# EasyEDA Pro project ZHub(instead of .json).epro

# Schematic usbhub
Board Name: usbhub; Create Date: 2025-08-07; Page Name: Sheet_1; Project Name: ZHub; Schematic Name: usbhub; Update Date: 2025-08-07; Add into BOM: yes; Company: Your Company; Convert to PCB: yes; Date: 2025-08-05; Draw By: wetcementstudios; REV: 1.0; Sheet: 1/1; spicePre: .
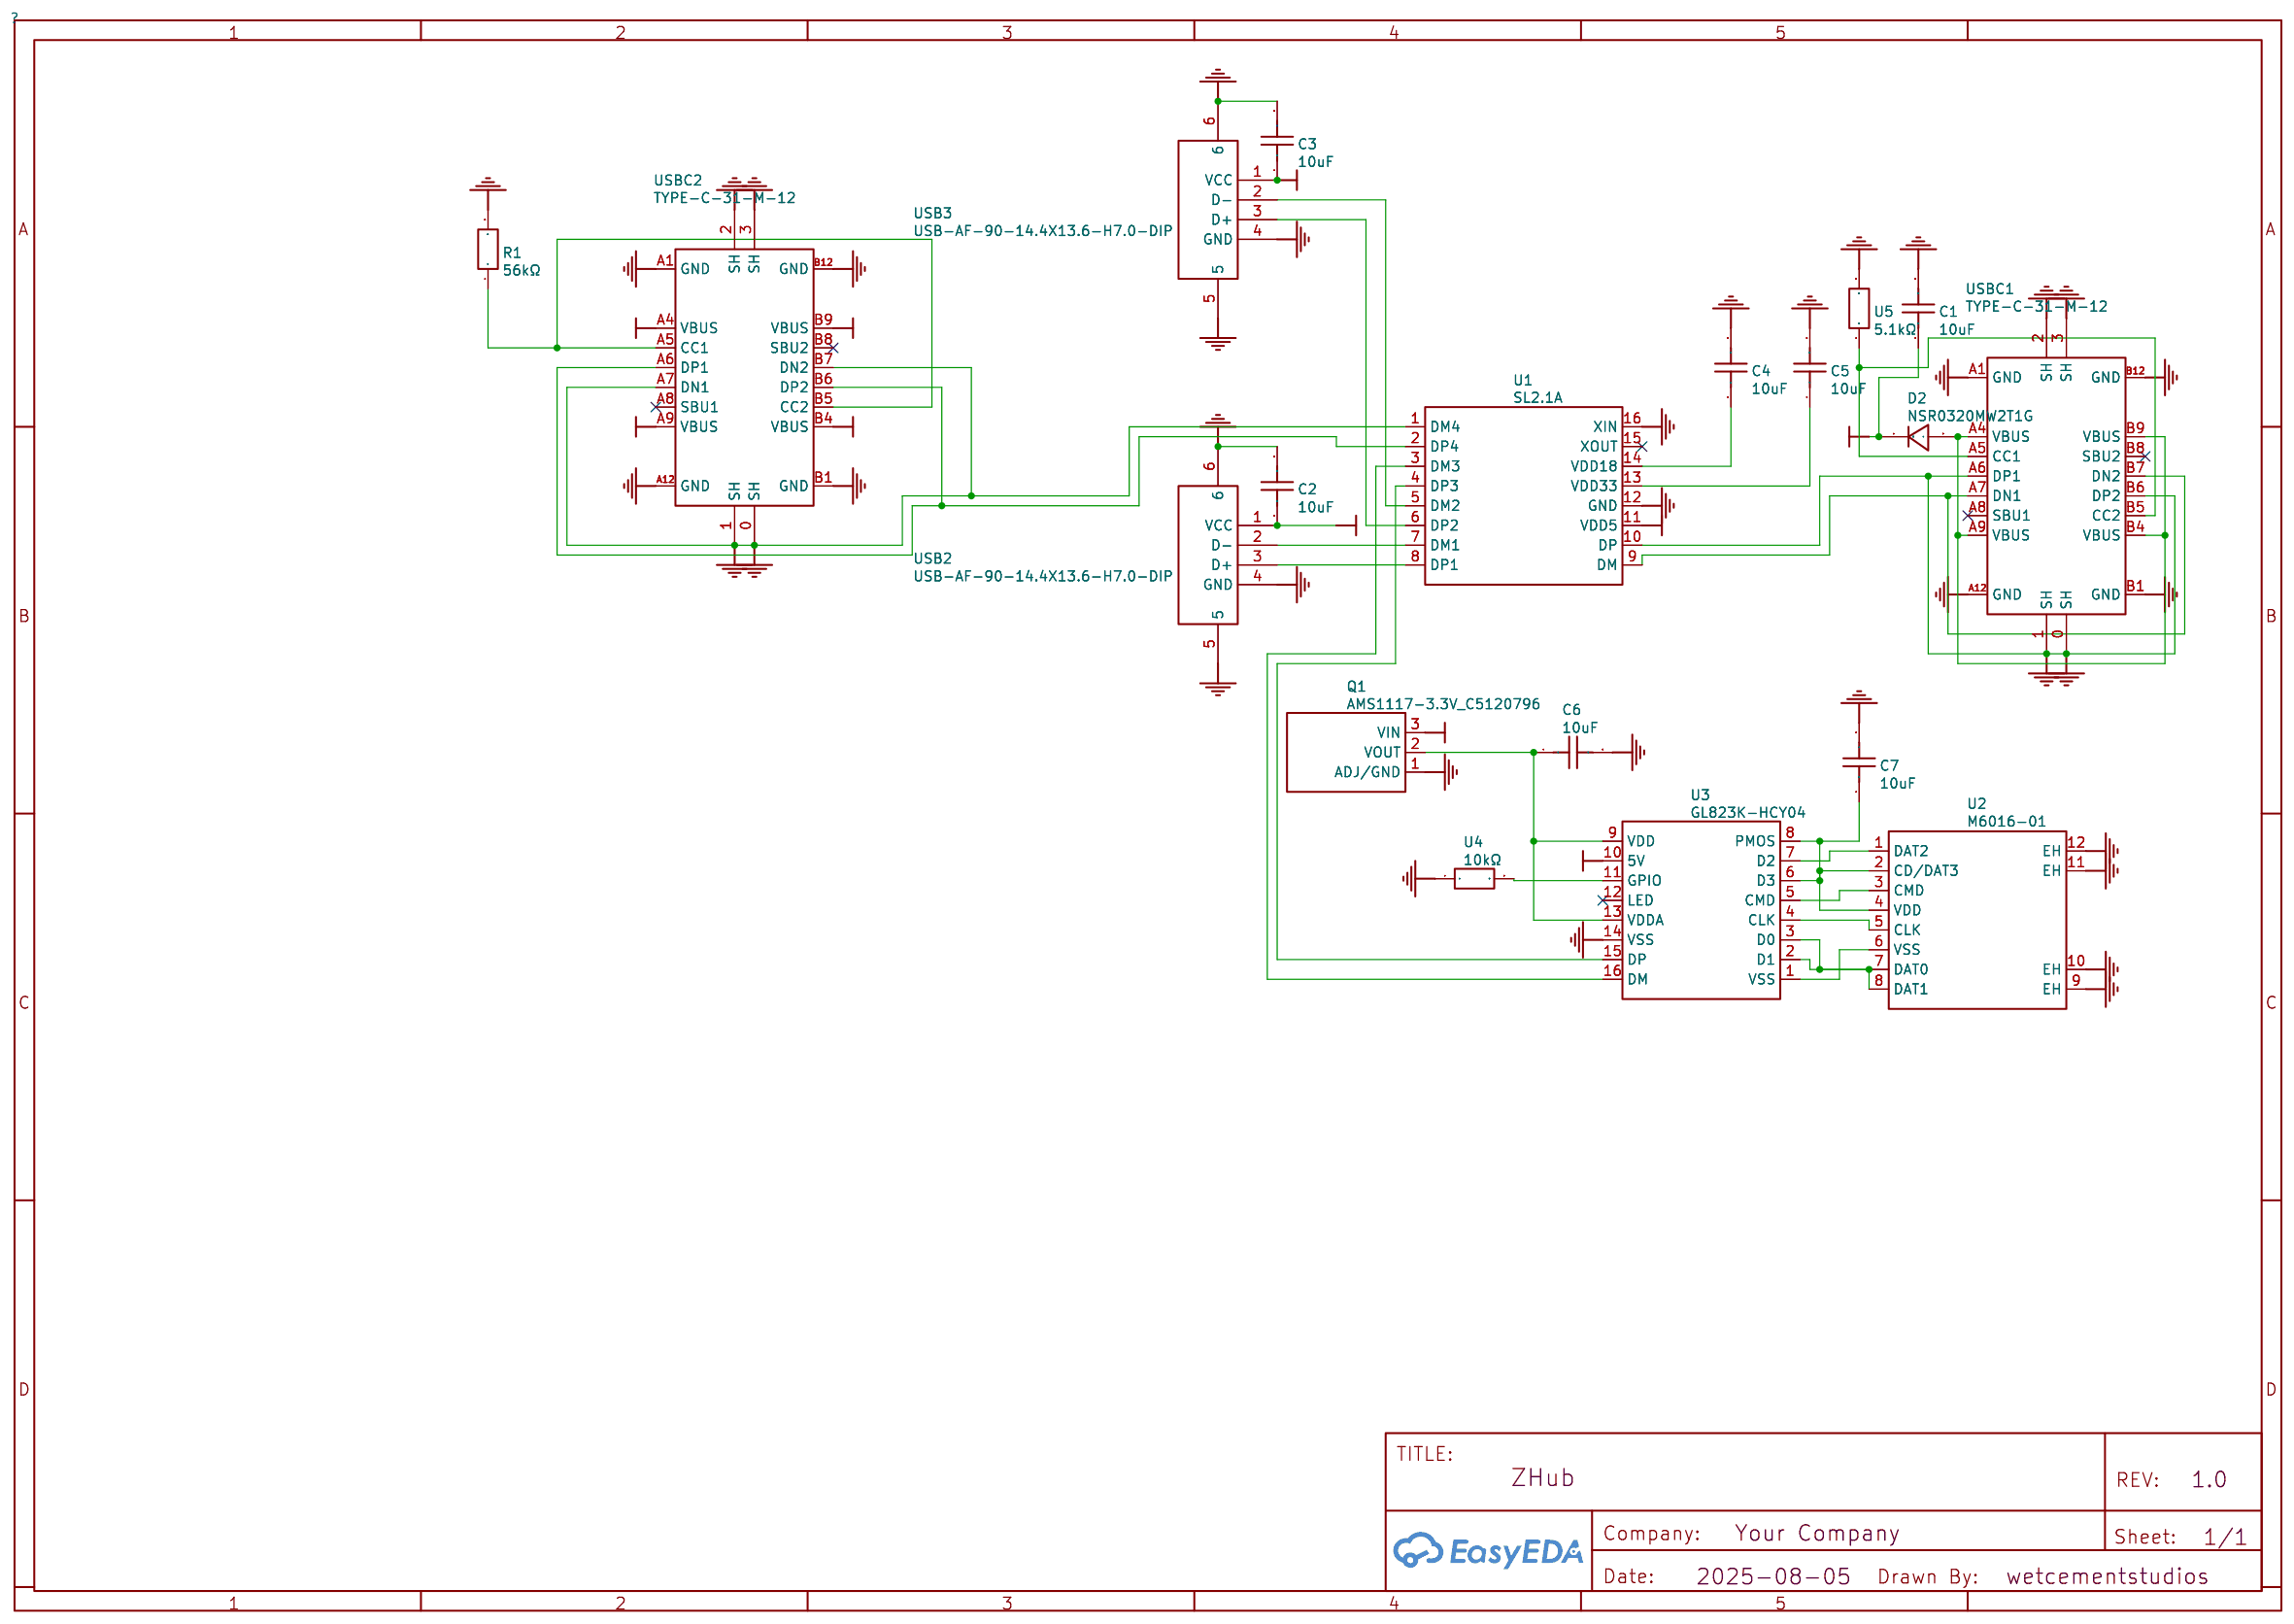
[diagram p0: schematic sheet]

## Parts
C1  10uF  [C0603]
C2  10uF  [C0603]
C3  10uF  [C0603]
C4  10uF  [C0603]
C5  10uF  [C0603]
C6  10uF  [C0603]
C7  10uF  [C0603]
D2  NSR0320MW2T1G  [SOD-323_L1.8-W1.3-LS2.5-RD]
Q1  AMS1117-3.3V_C5120796  [SOT-89-3_L4.5-W2.5-P1.50-LS4.2-BR]
R1  56kΩ  [RES-TH_BD2.3-L6.5-P10.50-D0.5]
U1  SL2.1A  [SOP-16_L10.0-W3.9-P1.27-LS6.0-BL]
U2  M6016-01  [MICRO-SD-SMD_M6016-01]
U3  GL823K-HCY04  [SSOP-16_L4.9-W3.9-P0.64-LS6.0-BL]
U4  10kΩ  [R0805]
U5  5.1kΩ  [RES-TH_BD5.0-L15.5-P19.50-D0.8]
USB2  USB-AF-90-14.4X13.6-H7.0-DIP  [USB-A-TH_C46407]
USB3  USB-AF-90-14.4X13.6-H7.0-DIP  [USB-A-TH_C46407]
USBC1  TYPE-C-31-M-12  [USB-C_SMD-TYPE-C-31-M-12]
USBC2  TYPE-C-31-M-12  [USB-C_SMD-TYPE-C-31-M-12]

## Library data of the parts
C1-C7 = 10uF: Supplier: LCSC; Manufacturer: SAMSUNG(三星); Manufacturer Part: CL10A106KP8NNNC; Supplier Part: C19702; JLCPCB Part Class: Basic Part; nameAlias: Value; spicePre: C; spiceSymbolName: CL10A106KP8NNNC
D2 = NSR0320MW2T1G: Supplier: LCSC; Manufacturer: onsemi(安森美); Supplier Part: C48192; JLCPCB Part Class: Extended Part; spicePre: D
Q1 = AMS1117-3.3V_C5120796: Supplier: LCSC; Supplier Part: C5120796; Manufacturer: MSKSEMI(美森科); Manufacturer Part: AMS1117-3.3V; JLCPCB Part Class: Extended Part; Contributor: lcsc; spicePre: Q
R1 = 56kΩ: Supplier: LCSC; Supplier Part: C385529; Manufacturer: Tyohm(幸亚电阻); Manufacturer Part: RN1/2WS56KΩFT/BA1; JLCPCB Part Class: Extended Part; nameAlias: Value; Contributor: LCSC; spicePre: R; spiceSymbolName: RN1/2WS56KΩFT/BA1
U1 = SL2.1A: Supplier Part: C192893; Supplier: LCSC; Manufacturer: CoreChips(和芯润德); JLCPCB Part Class: Extended Part; Contributor: LCSC; spicePre: U
U2 = M6016-01: Supplier: LCSC; Supplier Part: C20624808; Manufacturer: MUP(德海威); JLCPCB Part Class: Extended Part; Contributor: lcsc; spicePre: U
U3 = GL823K-HCY04: Supplier: LCSC; Supplier Part: C284879; Manufacturer: GENESYS(创惟); JLCPCB Part Class: Extended Part; Contributor: LCSC; spicePre: U
U4 = 10kΩ: Supplier: LCSC; Supplier Part: C2889436; Manufacturer: VO(翔胜); Manufacturer Part: 0805 ±1% 10K; JLCPCB Part Class: Extended Part; Contributor: lcsc; nameAlias: Value; spicePre: U; spiceSymbolName: 0805 ±1% 10K
U5 = 5.1kΩ: Supplier: LCSC; Supplier Part: C2903456; Manufacturer: VO(翔胜); Manufacturer Part: CR2W-5K1±5%-QT73; JLCPCB Part Class: Extended Part; Contributor: lcsc; nameAlias: Value; spicePre: U; spiceSymbolName: CR2W-5K1±5%-QT73
USB2 USB3 = USB-AF-90-14.4X13.6-H7.0-DIP: Supplier: LCSC; Supplier Part: C46407; Manufacturer: 精拓金; Manufacturer Part: 903-131A1011D10100; JLCPCB Part Class: Extended Part; Contributor: LCSC; spicePre: U
USBC1 USBC2 = TYPE-C-31-M-12: Supplier: LCSC; Supplier Part: C165948; Manufacturer: 韩国韩荣; JLCPCB Part Class: Extended Part; Contributor: LCSC; spicePre: U

## Nets
+5V: C1.1 C2.1 C3.1 D2.1(C) Q1.3(VIN) U1.11(VDD5) U3.10(5V) USB2.1(VCC) USB3.1(VCC) USBC2.A4(VBUS) USBC2.A9(VBUS) USBC2.B4(VBUS) USBC2.B9(VBUS)
GND: C1.2 C2.2 C3.2 C4.2 C5.2 C6.2 C7.2 Q1.1(ADJ/GND) R1.2 U1.1(DM4) U1.10(DP) U1.12(GND) U1.16(XIN) U2.9(EH) U2.10(EH) U2.11(EH) U2.12(EH) U3.14(VSS) U4.1 U5.2 USB2.4(GND) USB2.5 USB2.6 USB3.4(GND) USB3.5 USB3.6 USBC1.0(SH) USBC1.1(SH) USBC1.2(SH) USBC1.3(SH) USBC1.A1(GND) USBC1.A6(DP1) USBC1.A12(GND) USBC1.B1(GND) USBC1.B6(DP2) USBC1.B12(GND) USBC2.0(SH) USBC2.1(SH) USBC2.2(SH) USBC2.3(SH) USBC2.A1(GND) USBC2.A7(DN1) USBC2.A12(GND) USBC2.B1(GND) USBC2.B7(DN2) USBC2.B12(GND)
Net-(C6-1): C6.1 Q1.2(VOUT) U3.9(VDD) U3.13(VDDA)
Net-(C7-1): C7.1 U2.4(VDD) U3.8(PMOS)
Net-(D2-2): D2.2(A) USBC1.A4(VBUS) USBC1.A9(VBUS) USBC1.B4(VBUS) USBC1.B9(VBUS)
Net-(R1-1): R1.1 USBC2.A5(CC1) USBC2.B5(CC2)
Net-(U1-2): U1.2(DP4) USBC2.A6(DP1) USBC2.B6(DP2)
Net-(U1-3): U1.3(DM3) U3.16(DM)
Net-(U1-4): U1.4(DP3) U3.15(DP)
Net-(U1-9): U1.9(DM) USBC1.A7(DN1) USBC1.B7(DN2)
Net-(U2-1): U2.1(DAT2) U3.7(D2)
Net-(U2-2): U2.2(CD/DAT3) U3.6(D3)
Net-(U2-3): U2.3(CMD) U3.5(CMD)
Net-(U2-5): U2.5(CLK) U3.4(CLK)
Net-(U2-6): U2.6(VSS) U3.1(VSS)
Net-(U2-7): U2.7(DAT0) U2.8(DAT1) U3.2(D1) U3.3(D0)
Net-(U3-11): U3.11(GPIO) U4.2
Net-(U5-1): U5.1 USBC1.A5(CC1) USBC1.B5(CC2)
U1_13: C5.1 U1.13(VDD33)
U1_14: C4.1 U1.14(VDD18)
USB2_2: U1.7(DM1) USB2.2(D-)
USB2_3: U1.8(DP1) USB2.3(D+)
USB3_2: U1.5(DM2) USB3.2(D-)
USB3_3: U1.6(DP2) USB3.3(D+)

Not connected (* = marked no-connect by the designer): U1 15(XOUT)*; U3 12(LED)*; USBC1 A8(SBU1)* B8(SBU2)*; USBC2 A8(SBU1)* B8(SBU2)*

# Board zhub_old
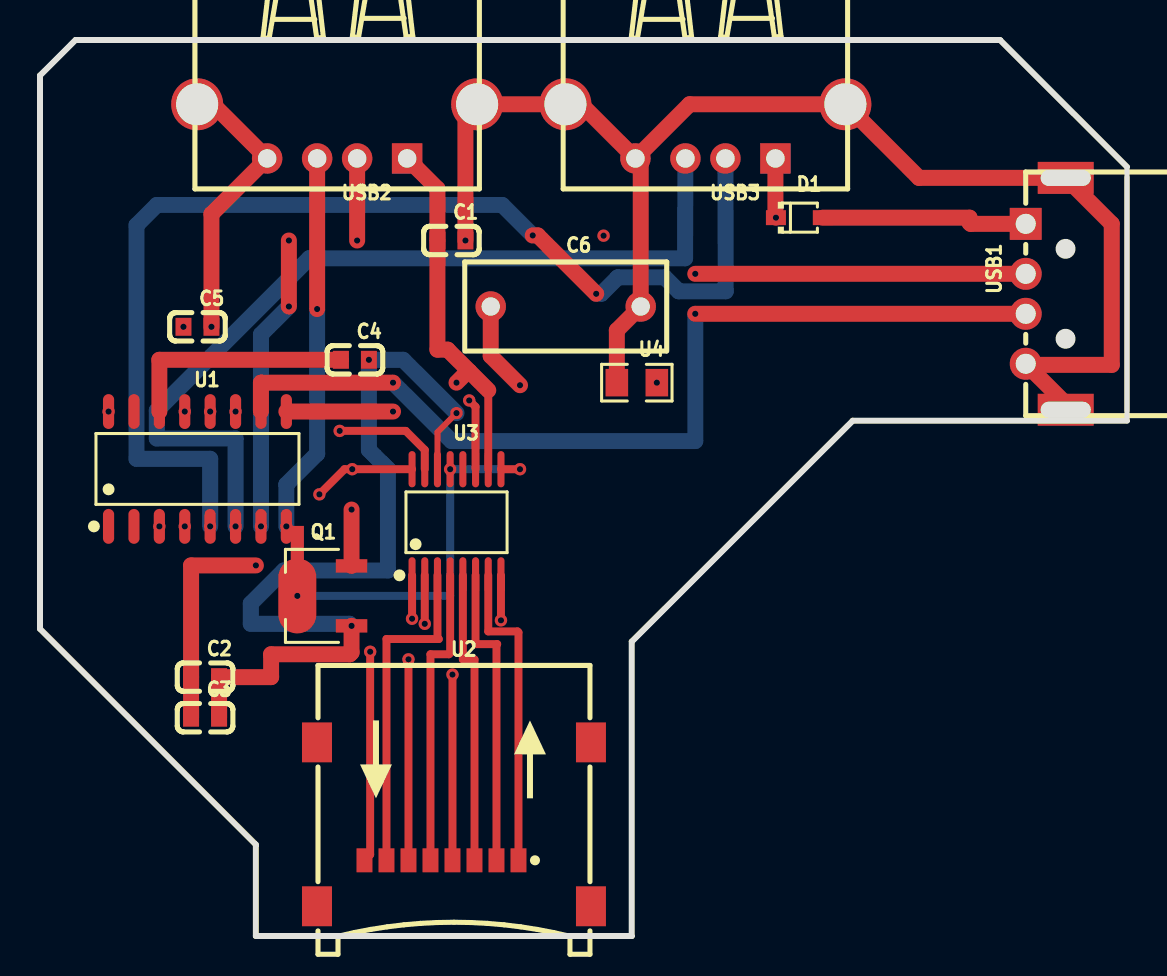
[diagram p1: board, top side]
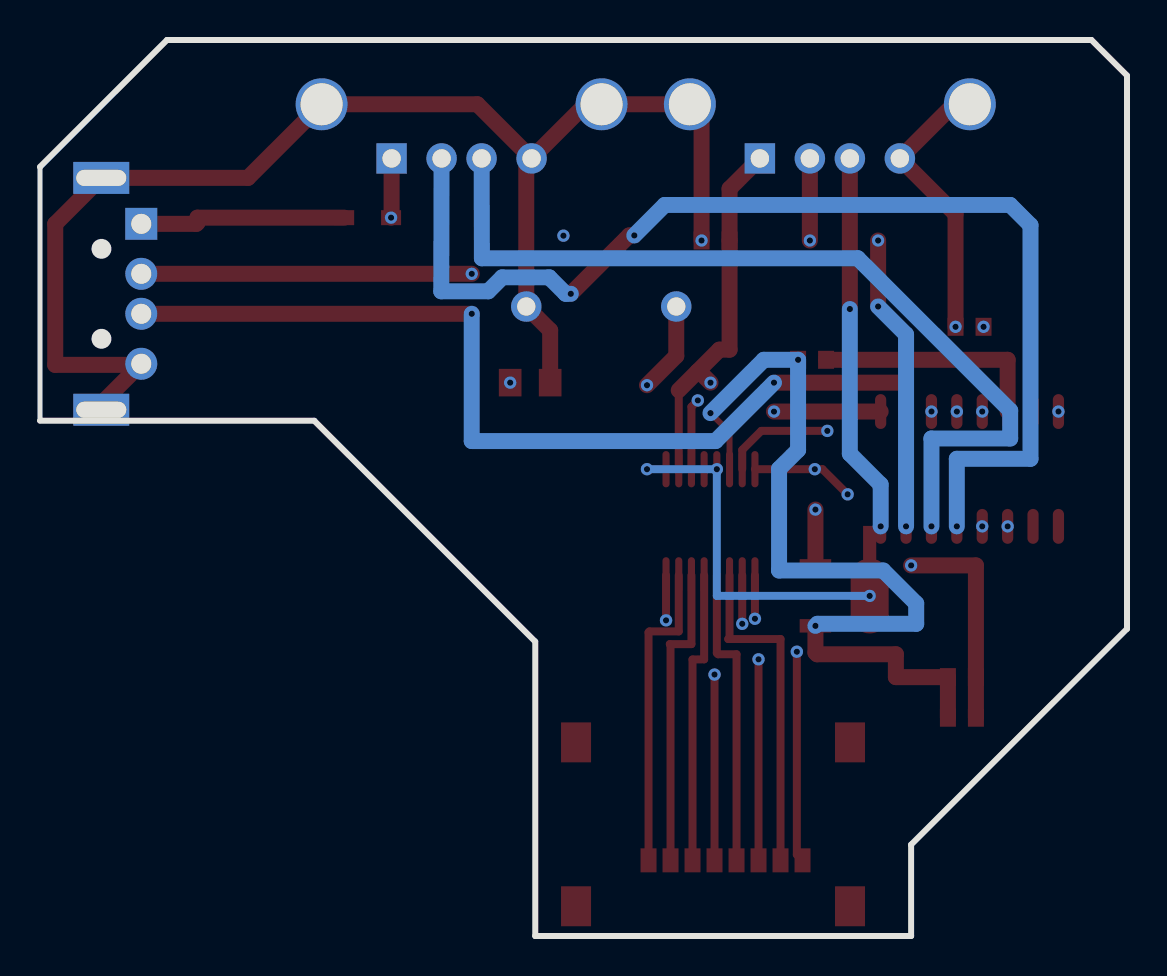
[diagram p2: board, bottom side, seen from below]

Outline 54.36 x 44.83 mm; copper layers: Top Layer, Inner1, Inner2, Bottom Layer. Coordinates in mm from the lower left corner of the outline.
Outline path: 54.36,38.48 48.01,44.83 1.78,44.83 0,43.05 0,15.37 10.8,4.57 10.8,0 29.59,0 29.59,14.73 40.64,25.78 54.36,25.78

## Design rules (mm)
via Default (default): diameter min 0.61, default 0.61, max 100.025; hole min 0.305, default 0.305, max 59.995

## Placement (name value [footprint] x y rotation side)
C1  10uF  [C0603]  20.57 34.8 0 top
C2  10uF  [C0603]  8.26 12.95 0 top
C3  10uF  [C0603]  8.26 10.92 0 top
C4  10uF  [C0603]  15.75 28.83 0 top
C5  10uF  [C0603]  7.87 30.48 0 top
C6  0.1UF  [CAP-TH_L10.0-W4.5-P7.50-D0.6]  26.29 31.5 0 top
D1  NSR0320MW2T1G  [SOD-323_L1.8-W1.3-LS2.5-RD]  37.97 35.94 0 top
Q1  AMS1117-3.3V_C5120796  [SOT-89-3_L4.5-W2.5-P1.50-LS4.2-BR]  14.22 17.02 0 top
U1  SL2.1A  [SOP-16_L10.0-W3.9-P1.27-LS6.0-BL]  7.87 23.37 0 top
U2  M6016-01  [MICRO-SD-SMD_M6016-01]  20.7 5.59 0 top
U3  GL823K-HCY04  [SSOP-16_L4.9-W3.9-P0.64-LS6.0-BL]  20.83 20.7 0 top
U4  10kΩ  [R0805]  29.85 27.69 0 top
USB1  U-G-04DD-W-01  [USB-A-TH_U-G-04WD-W-01]  50.29 32.13 90 top
USB2  USB-AF-90-14.4X13.6-H7.0-DIP  [USB-A-TH_C46407]  14.86 40.26 180 top
USB3  USB-AF-90-14.4X13.6-H7.0-DIP  [USB-A-TH_C46407]  33.27 40.26 180 top

## Footprints (pads in the part's own frame, mm; a bottom-side part is the same pattern mirrored in y, then rotated)
C0603
  rect 0.8x0.9 smd: 1(-0.7,0) 2(0.7,0)
CAP-TH_L10.0-W4.5-P7.50-D0.6
  round 1.524 hole 0.914: 1(-3.75,0) 2(3.75,0)
MICRO-SD-SMD_M6016-01
  rect 0.8x1.2 smd: 1(3.225,-1.8) 2(2.125,-1.8) 3(1.025,-1.8) 4(-0.075,-1.8) 5(-1.175,-1.8) 6(-2.275,-1.8) 7(-3.375,-1.8) 8(-4.475,-1.8)
  rect 1.5x2 smd: 9(6.85,4.1) 10(-6.85,4.1) 11(6.85,-4.1) 12(-6.85,-4.1)
R0805
  rect 1.133x1.377 smd: 1(-1,0) 2(1,0)
SOD-323_L1.8-W1.3-LS2.5-RD
  rect 1x0.75 smd: 1(-1.173,0) 2(1.173,0)
SOP-16_L10.0-W3.9-P1.27-LS6.0-BL
  oval 0.56x1.745 smd: 1(-4.445,-2.873) 2(-3.175,-2.873) 3(-1.905,-2.873) 4(-0.635,-2.873) 5(0.635,-2.873) 6(1.905,-2.873) 7(3.175,-2.873) 8(4.445,-2.873) 9(4.445,2.873) 10(3.175,2.873) 11(1.905,2.873) 12(0.635,2.873) 13(-0.635,2.873) 14(-1.905,2.873) 15(-3.175,2.873) 16(-4.445,2.873)
SOT-89-3_L4.5-W2.5-P1.50-LS4.2-BR
  rect 1.575x0.672 smd: 1(1.357,-1.5) 3(1.357,1.5)
  custom 1.9x5.377 smd: 2(-1.356,-0.001)
SSOP-16_L4.9-W3.9-P0.64-LS6.0-BL
  oval 0.355x1.815 smd: 1(-2.223,-2.655) 2(-1.587,-2.655) 3(-0.953,-2.655) 4(-0.318,-2.655) 5(0.318,-2.655) 6(0.953,-2.655) 7(1.587,-2.655) 8(2.223,-2.655) 9(2.223,2.655) 10(1.587,2.655) 11(0.953,2.655) 12(0.318,2.655) 13(-0.318,2.655) 14(-0.953,2.655) 15(-1.587,2.655) 16(-2.223,2.655)
USB-A-TH_C46407
  rect 1.524x1.524 hole 0.92: 1(-3.5,1.355)
  round 1.524 hole 0.92: 2(-1,1.355) 3(1,1.355) 4(3.5,1.355)
  round 2.6 hole 2.1: 5(7,-1.355) 6(-7,-1.355)
USB-A-TH_U-G-04WD-W-01
  rect 1.6x1.6 hole 1: 1(3.5,1)
  round 1.6 hole 1: 2(1,1) 3(-1,1) 4(-3.5,1)
  rect 1.6x2.8 hole 0.8x2.5: 5(5.8,-1) 6(-5.8,-1)

## Nets
+5V: C1.1 C2.1 C3.1 D1.1 Q1.3 U1.11 U3.10 USB2.1 USB3.1
GND: C1.2 C2.2 C3.2 C4.2 C5.2 C6.2 Q1.1 U1.12 U1.16 U3.14 U4.1 USB1.4 USB1.5 USB1.6 USB2.4 USB2.5 USB2.6 USB3.4 USB3.5 USB3.6
U1_3: U1.3 U3.16
U1_4: U1.4 U3.15
U1_13: C5.1 U1.13
U1_14: C4.1 U1.14
U2_1: U2.1 U3.7
U2_2: U2.2 U3.6
U2_3: U2.3 U3.5
U2_4: U2.4 U3.8
U2_5: U2.5 U3.4
U2_6: U2.6 U3.1
U2_7: U2.7 U3.3
U2_8: U2.8 U3.2
U2_9: U2.9
U2_10: U2.10
U2_11: U2.11
U2_12: U2.12
U3_9: C6.1 Q1.2 U3.9 U3.13
U3_11: U3.11 U4.2
U3_12: U3.12
USB1_1: D1.2 USB1.1
USB1_2: U1.9 USB1.2
USB1_3: U1.10 USB1.3
USB2_2: U1.7 USB2.2
USB2_3: U1.8 USB2.3
USB3_2: U1.5 USB3.2
USB3_3: U1.6 USB3.3

Pads without a net: U1 1 2 15

## Via types
v1: diameter 0.62, hole 0.31, Top Layer to Bottom Layer, 49 vias

## Routing (per net, layer and track width the routed paths; a pad name or vN(x,y) marks a point on that pad's centre or on a via; arc(x,y) is an arc through that point)
+5V: length 76.8
  Top Layer w0.4: U3.10 22.42,27.31
  Top Layer w0.8: 21.48,28.25 21.39,28.25 v1(20.83,27.69) ; USB3.1 36.77,35.97 v1(36.8,35.94) ; USB2.1 19.87,37.39 C1.1 19.87,29.34 20.38,29.34 22.42,27.31 ; Q1.3 v1(15.58,21.34) ; v1(10.8,18.54) 7.56,18.54 C2.1 C3.1
  Inner1 w0.8: v1(36.8,35.94) 29.08,35.94 v1(28.18,35.04) v1(20.83,27.69) 15.58,22.44 v1(15.58,21.34) 12.79,18.54 v1(10.8,18.54) ; v1(9.78,26.24) 12.69,23.33 16.47,23.33
GND: length 155.7
  Top Layer w0.3: v1(20.83,26.16) 19.88,25.21 U3.14
  Top Layer w0.8: v1(21.27,34.8) 21.27,41.03 USB2.6 USB3.5 27.06,41.61 USB3.4 ; 7.86,41.61 8.65,41.61 v1(11.36,38.9) 8.57,36.12 v1(8.57,30.48) ; C3.2 C2.2 11.56,12.95 11.56,14.1 15.49,14.1 15.58,14.18 v1(15.58,15.52) ; USB3.4 30.04,38.64 C6.2 28.85,30.3 U4.1 ; USB3.4 32.48,41.61 USB3.6 43.96,37.93 USB1.5 53.59,35.63 53.59,28.58 49.35,28.58 USB1.4 51.29,26.63 USB1.6
  Inner1 w0.8: v1(16.45,28.83) 16.45,29.97 v1(21.27,34.8)
  Inner2 w0.8: v1(8.51,26.24) 6.94,27.81 ; 6.94,27.81 3.43,27.81 v1(3.43,26.24) ; 6.94,27.81 6.94,28.84 v1(8.57,30.48) 14.8,30.48 v1(16.45,28.83)
  Bottom Layer w0.8: v1(20.83,26.16) 18.16,28.83 v1(16.45,28.83) 16.45,24.32 17.4,23.37 17.4,18.29 12.19,18.29 10.54,16.64 10.54,15.62 15.48,15.62 v1(15.58,15.52)
U1_3: length 13.8
  Top Layer w0.4: v1(13.97,22.1) 15.23,23.36 v1(15.61,23.36) U3.16
  Inner1 w0.4: v1(13.97,22.1) 7.57,22.1 v1(5.97,20.5)
U1_4: length 15.3
  Top Layer w0.4: v1(14.99,25.27) 18.29,25.27 19.24,24.32 U3.15
  Inner2 w0.4: v1(14.99,25.27) 12.02,25.27 v1(7.24,20.5)
U1_13: length 4.3
  Inner1 w0.8: v1(7.24,26.24) 7.24,30.42 v1(7.17,30.48)
U1_14: length 11.7
  Top Layer w0.8: U1.14 5.97,28.83 C4.1
U2_1: length 15.7
  Top Layer w0.4: U2.1 23.93,15.19 23.88,15.24 22.42,15.24 U3.7
U2_2: length 15.4
  Top Layer w0.4: U3.6 21.78,14.61 22.86,14.61 22.83,14.57 U2.2
U2_3: length 14.8
  Top Layer w0.4: U3.5 21.15,13.84 21.73,13.84 21.73,3.79
U2_4: length 15.3
  Top Layer w0.4: U2.4 v1(20.63,13.08) ; U3.8 v1(23.05,15.8)
  Inner1 w0.4: v1(23.05,15.8) 20.63,13.37 v1(20.63,13.08)
U2_5: length 15.2
  Top Layer w0.4: U2.5 19.53,14.1 20.45,14.1 20.51,14.16 U3.4
U2_6: length 14.3
  Top Layer w0.4: U3.1 v1(18.61,15.88) ; U2.6 v1(18.43,13.84)
  Inner2 w0.4: v1(18.43,13.84) 18.43,15.7 v1(18.61,15.88)
U2_7: length 16.9
  Top Layer w0.4: U2.7 17.33,14.86 19.94,14.86 19.88,14.92 U3.3
U2_8: length 16.3
  Top Layer w0.4: U2.8 16.51,4.07 v1(16.51,14.22) ; U3.2 v1(19.24,15.62)
  Inner1 w0.4: v1(16.51,14.22) 17.84,14.22 v1(19.24,15.62)
U3_9: length 29.3
  Top Layer w0.4: U3.9 v1(24,23.36)
  Top Layer w0.8: C6.1 22.54,29.02 v1(24,27.56)
  Inner2 w0.4: v1(20.51,23.36) 20.51,25.27 21.72,25.27 v1(24,27.56)
  Bottom Layer w0.4: v1(24,23.36) v1(20.51,23.36) 20.51,17.02 12.87,17.02
  vias: v1(12.87,17.02)
U3_11: length 13.3
  Top Layer w0.4: v1(21.46,26.8) 21.78,26.48 U3.11
  Inner1 w0.8: v1(30.85,27.69) 29.96,26.8 v1(21.46,26.8)
USB1_1: length 10.4
  Top Layer w0.8: D1.2 46.48,35.94 46.48,35.69 46.54,35.63 USB1.1
USB1_2: length 47.7
  Top Layer w0.8: U1.9 v1(17.65,26.24) ; USB1.2 v1(32.77,33.13)
  Inner2 w0.8: v1(17.65,26.24) 18.29,26.88 18.29,27.1 18.54,27.35 18.54,36.2 29.7,36.2 v1(32.77,33.13)
USB1_3: length 47.3
  Top Layer w0.8: USB1.3 v1(32.77,31.13) ; v1(17.65,27.69) 11.05,27.69 11.05,26.24
  Bottom Layer w0.8: v1(17.65,27.69) 20.57,24.77 32.77,24.77 v1(32.77,31.13)
USB2_2: length 22.4
  Top Layer w0.8: USB2.2 v1(15.86,34.8) ; v1(12.45,34.8) v1(12.45,31.5)
  Inner1 w0.8: v1(15.86,34.8) v1(12.45,34.8)
  Bottom Layer w0.8: v1(11.05,20.5) 11.05,30.1 v1(12.45,31.5)
USB2_3: length 19
  Top Layer w0.8: USB2.3 v1(13.86,31.37)
  Bottom Layer w0.8: v1(13.86,31.37) 13.86,24.13 12.32,22.59 v1(12.32,20.5)
USB3_2: length 57.7
  Top Layer w0.8: v1(24.64,35.05) 24.89,35.05 v1(27.81,32.13)
  Bottom Layer w0.8: v1(8.51,20.5) 8.51,23.88 4.83,23.88 4.83,35.56 5.84,36.58 23.11,36.58 v1(24.64,35.05) ; v1(27.81,32.13) 28.07,32.13 28.89,32.95 31.24,32.95 31.94,32.26 34.29,32.26 34.27,38.91
  vias: v1(34.27,38.9)
USB3_3: length 44.3
  Bottom Layer w0.8: v1(9.78,20.5) 9.78,24.89 5.84,24.89 5.84,26.29 13.46,33.91 32.26,33.91 32.27,38.91
  vias: v1(32.27,38.9)

# Board zhub_new
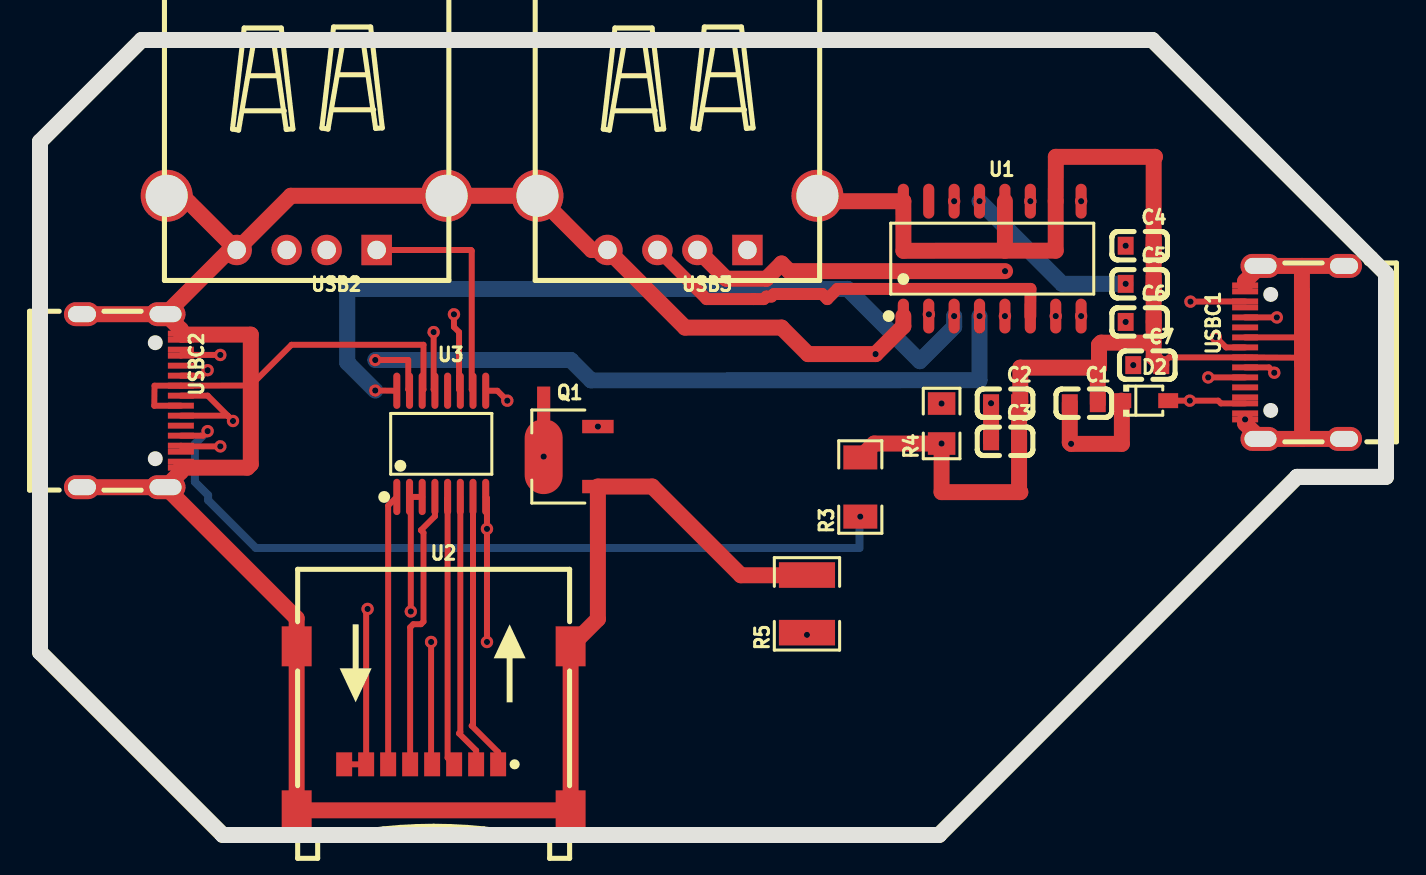
[diagram p3: board, top side]
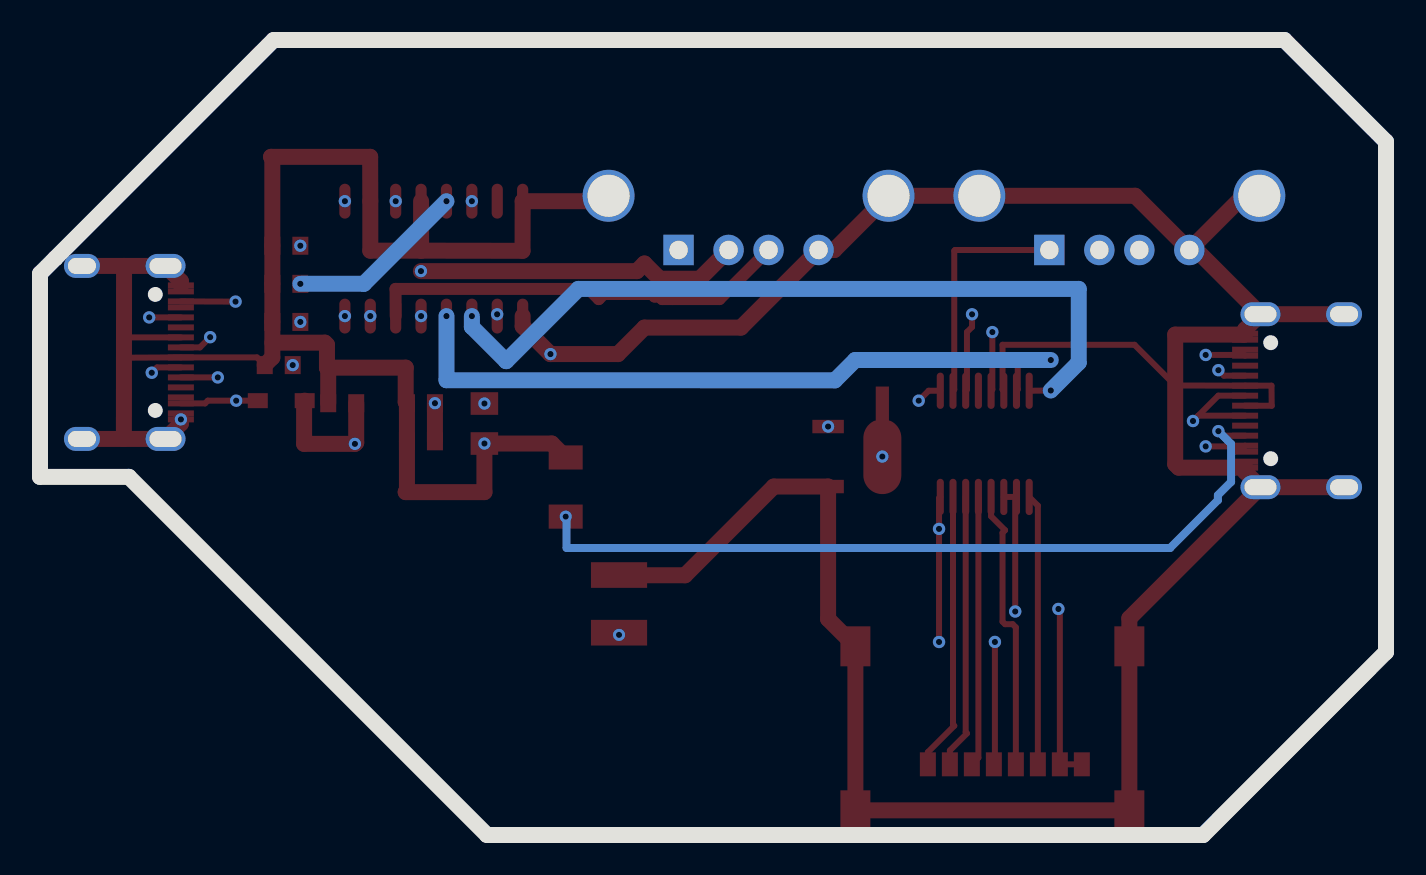
[diagram p4: board, bottom side, seen from below]

Outline 67.31 x 39.75 mm; copper layers: Top Layer, Inner1, Inner2, Bottom Layer. Coordinates in mm from the lower left corner of the outline.
Outline path: 0,34.67 0,9.14 9.14,0 44.96,0 62.86,17.91 67.31,17.91 67.31,28.07 55.63,39.75 5.08,39.75 0,34.67
Stack: Top Layer 0.035mm / Dielectric1 0.48mm PP er 4.5 / Inner1 0.035mm / Dielectric2 0.48mm FR4 er 4.5 / Inner2 0.035mm / Dielectric3 0.48mm PP er 4.5 / Bottom Layer 0.035mm

## Design rules (mm)
spacing Default (default): track to track 0.152, other pairs 0 to 0.152
track width Default (default): min 0.254, default 0.254, max 25.4
differential pair differentialPair (default): width min 0.127, default 0.254, max 2.54; gap min 0.152, default 0.152
via Default (default): diameter min 0.61, default 0.61, max 100.025; hole min 0.305, default 0.305, max 59.995

## Placement (name value [footprint] x y rotation side)
C1  10uF  [C0603]  52.2 21.59 0 top
C2  10uF  [C0603]  48.26 21.59 0 top
C3  10uF  [C0603]  48.26 19.69 0 top
C4  10uF  [C0603]  54.99 29.46 0 top
C5  10uF  [C0603]  54.99 27.56 0 top
C6  10uF  [C0603]  54.99 25.65 0 top
C7  10uF  [C0603]  55.37 23.49 0 top
D2  NSR0320MW2T1G  [SOD-323_L1.8-W1.3-LS2.5-RD]  55.24 21.72 0 top
Q1  AMS1117-3.3V_C5120796  [SOT-89-3_L4.5-W2.5-P1.50-LS4.2-BR]  26.54 18.92 0 top
R3  56kΩ  [R1206]  41.02 17.4 90 top
R4  10kΩ  [R0805]  45.09 20.57 90 top
R5  5.1kΩ  [R1210]  38.35 11.56 90 top
U1  SL2.1A  [SOP-16_L10.0-W3.9-P1.27-LS6.0-BL]  47.62 28.82 0 top
U2  M6016-01  [MICRO-SD-SMD_M6016-01]  19.68 5.33 0 top
U3  GL823K-HCY04  [SSOP-16_L4.9-W3.9-P0.64-LS6.0-BL]  20.07 19.56 0 top
USB2  USB-AF-90-14.4X13.6-H7.0-DIP  [USB-A-TH_C46407]  13.33 30.61 180 top
USB3  USB-AF-90-14.4X13.6-H7.0-DIP  [USB-A-TH_C46407]  31.88 30.61 180 top
USBC1  TYPE-C-31-M-12  [USB-C_SMD-TYPE-C-31-M-12]  62.74 24.13 90 top
USBC2  TYPE-C-31-M-12  [USB-C_SMD-TYPE-C-31-M-12]  4.57 21.72 270 top

## Footprints (pads in the part's own frame, mm; a bottom-side part is the same pattern mirrored in y, then rotated)
C0603
  rect 0.8x0.9 smd: 1(-0.7,0) 2(0.7,0)
MICRO-SD-SMD_M6016-01
  rect 0.8x1.2 smd: 1(3.225,-1.8) 2(2.125,-1.8) 3(1.025,-1.8) 4(-0.075,-1.8) 5(-1.175,-1.8) 6(-2.275,-1.8) 7(-3.375,-1.8) 8(-4.475,-1.8)
  rect 1.5x2 smd: 9(6.85,4.1) 10(-6.85,4.1) 11(6.85,-4.1) 12(-6.85,-4.1)
R0805
  rect 1.133x1.377 smd: 1(-1,0) 2(1,0)
R1206
  rect 1.208x1.701 smd: 1(-1.479,0) 2(1.479,0)
R1210
  rect 1.282x2.808 smd: 1(-1.441,0) 2(1.441,0)
SOD-323_L1.8-W1.3-LS2.5-RD
  rect 1x0.75 smd: 1(-1.173,0) 2(1.173,0)
SOP-16_L10.0-W3.9-P1.27-LS6.0-BL
  oval 0.56x1.745 smd: 1(-4.445,-2.873) 2(-3.175,-2.873) 3(-1.905,-2.873) 4(-0.635,-2.873) 5(0.635,-2.873) 6(1.905,-2.873) 7(3.175,-2.873) 8(4.445,-2.873) 9(4.445,2.873) 10(3.175,2.873) 11(1.905,2.873) 12(0.635,2.873) 13(-0.635,2.873) 14(-1.905,2.873) 15(-3.175,2.873) 16(-4.445,2.873)
SOT-89-3_L4.5-W2.5-P1.50-LS4.2-BR
  rect 1.575x0.672 smd: 1(1.357,-1.5) 3(1.357,1.5)
  custom 1.9x5.377 smd: 2(-1.356,-0.001)
SSOP-16_L4.9-W3.9-P0.64-LS6.0-BL
  oval 0.355x1.815 smd: 1(-2.223,-2.655) 2(-1.587,-2.655) 3(-0.953,-2.655) 4(-0.318,-2.655) 5(0.318,-2.655) 6(0.953,-2.655) 7(1.587,-2.655) 8(2.223,-2.655) 9(2.223,2.655) 10(1.587,2.655) 11(0.953,2.655) 12(0.318,2.655) 13(-0.318,2.655) 14(-0.953,2.655) 15(-1.587,2.655) 16(-2.223,2.655)
USB-A-TH_C46407
  rect 1.524x1.524 hole 0.92: 1(-3.5,1.355)
  round 1.524 hole 0.92: 2(-1,1.355) 3(1,1.355) 4(3.5,1.355)
  round 2.6 hole 2.1: 5(7,-1.355) 6(-7,-1.355)
USB-C_SMD-TYPE-C-31-M-12
  oval 1.2x2 hole 0.8x1.6: 0(-4.325,1.706) 1(4.325,1.706)
  oval 1.2x1.8 hole 0.8x1.4: 2(4.325,-2.474) 3(-4.325,-2.474)
  rect 0.3x1.3 smd: A1(-3.35,2.474) A4(-2.55,2.474) A5(-1.25,2.474) A6(-0.25,2.474) A7(0.25,2.474) A8(1.25,2.474) A9(2.55,2.474) A12(3.35,2.474) B1(3.05,2.474) B4(2.25,2.474) B5(1.75,2.474) B6(0.75,2.474) B7(-0.75,2.474) B8(-1.75,2.474) B9(-2.25,2.474) B12(-3.05,2.474)

## Nets
+5V: C1.1 C2.1 C3.1 D2.1 Q1.3 U1.11 U3.10 USB2.1 USB3.1 USBC2.A4 USBC2.A9 USBC2.B4 USBC2.B9
GND: C1.2 C2.2 C3.2 C4.2 C5.2 C6.2 C7.2 Q1.1 R3.2 R4.1 R5.2 U1.1 U1.10 U1.12 U1.16 U2.9 U2.10 U2.11 U2.12 U3.14 USB2.4 USB2.5 USB2.6 USB3.4 USB3.5 USB3.6 USBC1.0 USBC1.1 USBC1.2 USBC1.3 USBC1.A1 USBC1.A6 USBC1.A12 USBC1.B1 USBC1.B6 USBC1.B12 USBC2.0 USBC2.1 USBC2.2 USBC2.3 USBC2.A1 USBC2.A7 USBC2.A12 USBC2.B1 USBC2.B7 USBC2.B12
U1_2: U1.2 USBC2.A6 USBC2.B6
U1_3: U1.3 U3.16
U1_4: U1.4 U3.15
U1_9: U1.9 USBC1.A7 USBC1.B7
U1_13: C5.1 U1.13
U1_14: C4.1 U1.14
U2_1: U2.1 U3.7
U2_2: U2.2 U3.6
U2_3: U2.3 U3.5
U2_4: C7.1 U2.4 U3.8
U2_5: U2.5 U3.4
U2_6: U2.6 U3.1
U2_7: U2.7 U2.8 U3.2 U3.3
U3_9: C6.1 Q1.2 U3.9 U3.13
U3_11: R4.2 U3.11
USB2_2: U1.7 USB2.2
USB2_3: U1.8 USB2.3
USB3_2: U1.5 USB3.2
USB3_3: U1.6 USB3.3
USBC1_B4: D2.2 USBC1.A4 USBC1.A9 USBC1.B4 USBC1.B9
USBC1_B5: R5.1 USBC1.A5 USBC1.B5
USBC2_B5: R3.1 USBC2.A5 USBC2.B5

Pads without a net: U1 15; U3 12; USBC1 A8 B8; USBC2 A8 B8

## Via types
v1: diameter 0.61, hole 0.305, Top Layer to Bottom Layer, 2 vias
v2: diameter 0.62, hole 0.31, Top Layer to Bottom Layer, 44 vias

## Routing (per net, layer and track width the routed paths; a pad name or vN(x,y) marks a point on that pad's centre or on a via; arc(x,y) is an arc through that point)
+5V: length 96.6
  Top Layer w0.3: U3.10 21.59,22.28 21.59,29.21 21.55,29.25 USB2.1 ; USBC2.B9 7.08,24 v2(9.02,24) ; v2(9.02,19.43) 7.08,19.43 USBC2.B4
  Top Layer w0.8: C1.1 51.5,19.62 v2(51.56,19.56) 54.1,19.56 54.1,21.69 D2.1 ; 47.56,19.69 v2(47.56,21.59)
  Inner1 w0.3: v2(9.02,19.43) v2(9.02,24) 11.59,24 USB2.1
  Inner1 w0.8: v2(47.56,21.59) 49.52,23.55 v2(49.52,31.69) 47.08,29.25 USB3.1
  Inner2 w0.8: USB2.1 19.07,29.25 v2(27.9,20.42) 35.38,27.9 USB3.1 ; v2(47.56,21.59) 49.53,21.59 v2(51.56,19.56)
GND: length 252.8
  Top Layer w0.3: U3.14 19.18,22.28 19.18,24.51 12.58,24.51 10.54,22.48 USBC2.B7 5.73,22.47 5.71,21.46 7.05,21.47 ; 63.11,23.87 USBC1.A6 56.46,23.88 C7.2 ; 60.26,24.88 63.11,24.88
  Top Layer w0.8: 38.35,13.08 38.26,12.99 35.05,12.99 30.62,17.42 Q1.1 27.9,10.8 U2.9 26.53,1.23 12.83,1.23 U2.10 12.83,10.83 USBC2.1 ; R3.2 41.72,19.57 v2(45.08,19.57) 45.08,17.14 49.02,17.14 48.96,17.21 C3.2 C2.2 49.02,21.65 49.02,23.37 52.96,23.37 ; USBC2.0 7.05,25.27 USBC2.A1 7.09,25.02 10.54,25.02 10.54,18.54 10.37,18.37 USBC2.A12 7.05,18.16 USBC2.1 ; USBC2.0 9.49,29.25 USB2.4 ; USBC2.0 USBC2.3 ; USBC1.A12 60.26,27.69 USBC1.1 USBC1.2 ; 63.11,28.46 63.11,19.8 ; v2(60.26,20.78) 60.26,20.57 USBC1.0 USBC1.3 ; USB2.4 12.55,31.96 USB2.6 USB3.5 27.59,29.25 USB3.4 32.26,25.37 37.08,25.37 38.41,24.05 v2(41.78,24.05) 43.17,25.44 U1.1 ; USB2.4 7.12,31.96 USB2.5 ; USBC2.2 USBC2.1 ; USB3.6 39.15,31.69 U1.16 43.18,29.21 48.25,29.22 ; 52.96,23.37 52.9,23.31 C1.2 ; 52.96,23.37 52.96,24.51 53.07,24.62 55.69,24.62 ; 48.25,29.22 50.79,29.22 U1.10 50.8,33.91 55.75,33.91 55.69,33.85 C4.2 C5.2 C6.2 55.69,23.88 C7.2 ; 48.25,29.22 U1.12
  Inner2 w0.8: v2(41.78,24.05) 41.78,22.88 v2(45.08,19.57)
U1_2: length 50
  Top Layer w0.3: USBC2.B6 9.39,20.97 v2(9.65,20.7) 8.39,21.97 USBC2.A6
  Inner1 w0.4: v2(44.45,26.03) 44.45,22.99 40.26,22.99 40.26,26.54 39.88,26.92 15.87,26.92 v2(9.65,20.7)
U1_3: length 39.8
  Top Layer w0.3: U3.16 v2(16.76,22.22)
  Bottom Layer w0.8: v2(45.71,25.95) 45.71,25.41 44,23.69 40.39,27.3 15.37,27.3 15.37,23.62 v2(16.76,22.22)
U1_4: length 37.1
  Top Layer w0.3: U3.15 18.42,22.28 18.42,23.75 v2(16.76,23.75)
  Bottom Layer w0.8: 46.98,25.95 46.98,22.74 27.56,22.73 26.54,23.75 v2(16.76,23.75)
  vias: v2(46.98,25.95)
U1_9: length 20.4
  Top Layer w0.3: USBC1.B7 61.46,23.38 v2(61.72,23.11) ; USBC1.A7 59.31,24.38 v2(58.8,24.89)
  Inner1 w0.8: v2(61.72,23.11) 60.58,23.11 v2(58.8,24.89) 58.8,31.62 52.13,31.62 v2(52.06,31.69)
U1_13: length 9
  Bottom Layer w0.8: v2(54.29,27.56) 51.12,27.56 v2(46.98,31.69)
U1_14: length 9.5
  Inner2 w0.8: v2(45.71,31.69) 47.94,29.46 v2(54.29,29.46)
U2_1: length 13.9
  Top Layer w0.3: 22.91,3.53 22.91,4.14 21.59,5.46 21.65,5.52 U3.7
U2_2: length 13.7
  Top Layer w0.3: 21.81,3.53 21.81,4.22 20.95,5.08 21.02,5.14 U3.6
U2_3: length 13.5
  Top Layer w0.3: 20.71,3.53 20.38,3.86 U3.5
U2_4: length 55.5
  Top Layer w0.3: U3.8 22.35,16.84 v2(22.35,9.65) ; 19.61,3.53 19.56,3.59 v2(19.56,9.65)
  Inner1 w0.8: v2(19.56,9.65) v2(22.35,9.65) ; 22.35,15.31 24.45,17.4 54.61,17.4 54.67,17.46 v2(54.67,23.49)
  vias: v2(22.35,15.31)
U2_5: length 14.2
  Top Layer w0.3: U3.4 19.75,15.94 19.05,15.24 19.18,15.11 19.18,10.67 19.05,10.54 18.67,10.54 18.51,10.38 18.51,3.53
U2_6: length 13.5
  Top Layer w0.3: U3.1 17.41,16.47 17.41,3.53
U2_7: length 17.5
  Top Layer w0.3: v2(16.38,11.3) 16.31,11.23 16.31,3.53 15.21,3.53 ; U3.3 U3.2 18.54,16.84 v2(18.54,11.18)
  Inner1 w0.8: v2(16.38,11.3) 18.42,11.3 v2(18.54,11.18)
U3_9: length 44.8
  Top Layer w0.3: v2(19.68,25.15) 19.68,22.28 U3.13 ; v2(23.37,21.72) 22.87,22.21 U3.9
  Inner1 w0.8: v2(19.68,25.15) 19.94,25.15 v2(23.37,21.72) 23.37,20.74 v2(25.19,18.92) 42.54,18.92 44.2,20.57 49.21,20.57 v2(54.29,25.65)
U3_11: length 30.2
  Top Layer w0.3: U3.11 20.95,22.28 20.95,25.15 20.7,25.4 v2(20.7,26.03)
  Inner1 w0.8: v2(45.08,21.57) 25.16,21.57 v2(20.7,26.03)
USB2_2: length 49
  Inner1 w0.8: USB2.2 14.22,29.36 14.22,33.91 50.42,33.91 50.8,33.53 50.79,25.95
  vias: v2(50.79,25.95)
USB2_3: length 48.6
  Inner2 w0.8: USB2.3 12.33,34.02 33.27,34.04 37.46,29.84 42.42,29.84 44.96,27.3 52.06,27.3 52.06,25.95
  vias: v2(52.06,25.95)
USB3_2: length 18.7
  Top Layer w0.8: v2(48.26,28.19) 37.46,28.19 37.08,28.58 36.32,27.81 34.32,27.81 32.88,29.25
  Inner1 w0.8: v2(48.26,28.19) 48.25,25.95
  vias: v2(48.25,25.95)
USB3_3: length 21.4
  Top Layer w0.6: 49.52,25.95 49.53,27.3 39.88,27.3 39.37,26.8 39.12,27.05 36.71,27.05 36.58,26.92 36.32,26.92 36.2,26.8 33.33,26.8 USB3.3
USBC1_B4: length 11.6
  Top Layer w0.3: D2.2 v2(57.5,21.72) 58.92,21.72 59.05,21.58 USBC1.A4 ; USBC1.A9 v2(57.53,26.67)
  Inner1 w0.8: v2(57.5,21.72) 57.5,26.64 v2(57.53,26.67)
USBC1_B5: length 35.7
  Top Layer w0.3: USBC1.A5 v2(58.42,22.88) ; USBC1.B5 v2(61.85,25.88)
  Inner2 w0.8: v1(38.35,10.01) 49.25,10.01 58.42,19.18 v2(58.42,22.88) 61.42,25.88 v2(61.85,25.88)
USBC2_B5: length 45.1
  Top Layer w0.3: USBC2.A5 8.11,22.97 v2(8.38,23.24) ; v2(8.38,20.19) 8.16,19.97 USBC2.B5
  Inner1 w0.3: v2(8.38,23.24) v2(8.38,20.19)
  Bottom Layer w0.4: 41.02,15.88 40.98,15.83 40.98,14.35 10.8,14.35 8.41,16.74 8.41,16.99 7.75,17.65 7.75,19.56 v2(8.38,20.19) 8.41,20.17
  vias: v1(41.02,15.92)

# Board first
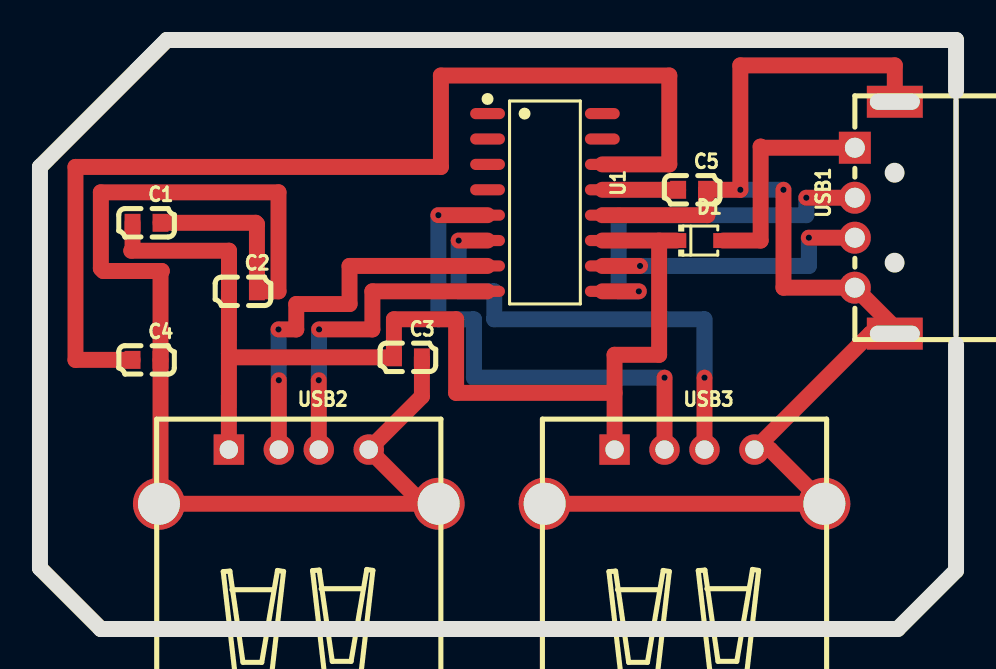
[diagram p5: board, top side]
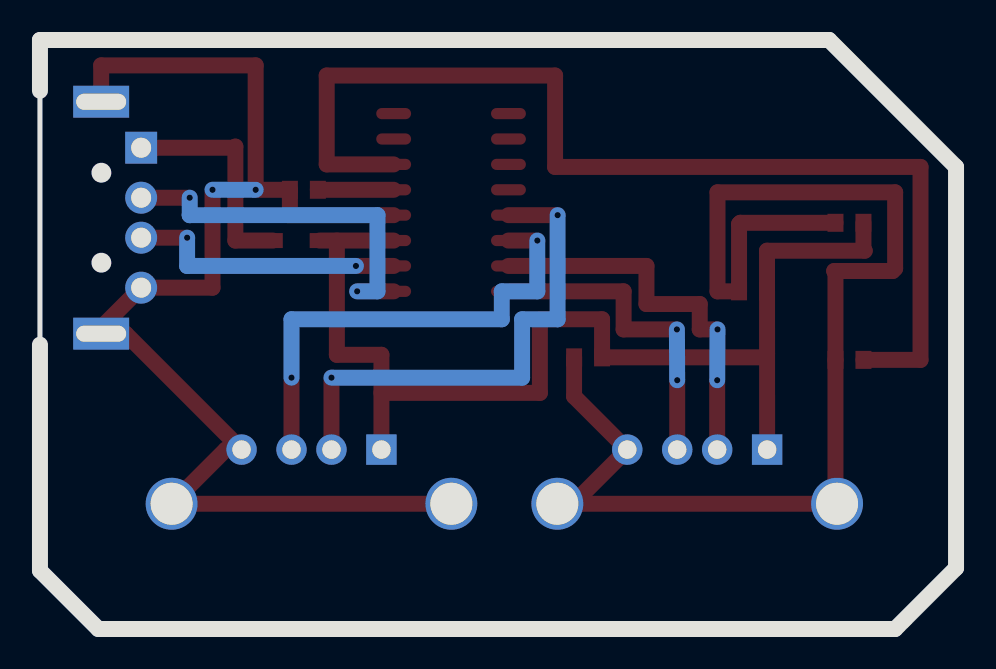
[diagram p6: board, bottom side, seen from below]

Outline 45.85 x 29.46 mm; copper layers: Top Layer, Bottom Layer. Coordinates in mm from the lower left corner of the outline.
Outline path: 45.85,26.92 45.85,29.46 6.35,29.46 0,23.11 0,3.05 3.05,0 42.93,0 45.85,2.92 45.85,14.22
Stack: Top Layer 0.035mm / Dielectric1 1.51mm FR4 er 4.5 / Bottom Layer 0.035mm

## Design rules (mm)
spacing Default (default): track to track 0.152, other pairs 0 to 0.152
track width Default (default): min 0.254, default 0.254, max 25.4
differential pair differentialPair (default): width min 0.127, default 0.254, max 2.54; gap min 0.152, default 0.152
via Default (default): diameter min 0.61, default 0.61, max 100.025; hole min 0.305, default 0.305, max 59.995

## Placement (name value [footprint] x y rotation side)
C1  10uF  [C0603]  5.33 20.32 0 top
C2  10uF  [C0603]  10.16 16.89 0 top
C3  10uF  [C0603]  18.41 13.59 0 top
C4  10uF  [C0603]  5.33 13.46 0 top
C5  10uF  [C0603]  32.64 21.97 0 top
D1  NSR0320MW2T1G  [SOD-323_L1.8-W1.3-LS2.5-RD]  33.02 19.43 0 top
U1  SL2.1A  [SOP-16_L10.0-W3.9-P1.27-LS6.0-BL]  25.27 21.34 270 top
USB1  U-G-04DD-W-01  [USB-A-TH_U-G-04WD-W-01]  41.78 20.57 90 top
USB2  USB-AF-90-14.4X13.6-H7.0-DIP  [USB-A-TH_C46407]  12.95 7.62 0 top
USB3  USB-AF-90-14.4X13.6-H7.0-DIP  [USB-A-TH_C46407]  32.26 7.62 0 top

## Footprints (pads in the part's own frame, mm; a bottom-side part is the same pattern mirrored in y, then rotated)
C0603
  rect 0.8x0.9 smd: 1(-0.7,0) 2(0.7,0)
SOD-323_L1.8-W1.3-LS2.5-RD
  rect 1x0.75 smd: 1(-1.173,0) 2(1.173,0)
SOP-16_L10.0-W3.9-P1.27-LS6.0-BL
  oval 0.56x1.745 smd: 1(-4.445,-2.873) 2(-3.175,-2.873) 3(-1.905,-2.873) 4(-0.635,-2.873) 5(0.635,-2.873) 6(1.905,-2.873) 7(3.175,-2.873) 8(4.445,-2.873) 9(4.445,2.873) 10(3.175,2.873) 11(1.905,2.873) 12(0.635,2.873) 13(-0.635,2.873) 14(-1.905,2.873) 15(-3.175,2.873) 16(-4.445,2.873)
USB-A-TH_C46407
  rect 1.524x1.524 hole 0.92: 1(-3.5,1.355)
  round 1.524 hole 0.92: 2(-1,1.355) 3(1,1.355) 4(3.5,1.355)
  round 2.6 hole 2.1: 5(7,-1.355) 6(-7,-1.355)
USB-A-TH_U-G-04WD-W-01
  rect 1.6x1.6 hole 1: 1(3.5,1)
  round 1.6 hole 1: 2(1,1) 3(-1,1) 4(-3.5,1)
  rect 1.6x2.8 hole 0.8x2.5: 5(5.8,-1) 6(-5.8,-1)

## Nets
+5V: C1.1 C2.1 C3.1 D1.1 U1.11 USB2.1 USB3.1
GND: C1.2 C2.2 C3.2 C4.2 C5.2 U1.12 U1.16 USB1.4 USB1.5 USB1.6 USB2.4 USB2.5 USB2.6 USB3.4 USB3.5 USB3.6
U1_13: C5.1 U1.13
U1_14: C4.1 U1.14
USB1_1: D1.2 USB1.1
USB1_2: U1.9 USB1.2
USB1_3: U1.10 USB1.3
USB2_2: U1.7 USB2.2
USB2_3: U1.8 USB2.3
USB3_2: U1.5 USB3.2
USB3_3: U1.6 USB3.3

Pads without a net: U1 1 2 3 4 15

## Via types
v1: diameter 0.62, hole 0.31, Top Layer to Bottom Layer, 14 vias

## Routing (per net, layer and track width the routed paths; a pad name or vN(x,y) marks a point on that pad's centre or on a via; arc(x,y) is an arc through that point)
+5V: length 57.6
  Top Layer w0.8: 30.99,19.43 30.99,13.72 28.76,13.72 USB3.1 ; 9.46,13.8 9.67,13.59 C3.1 17.72,15.49 20.83,15.49 20.83,11.81 28.76,11.81 ; C1.1 4.63,18.98 4.57,18.92 9.46,18.92 C2.1 9.45,8.97 ; U1.11 D1.1
GND: length 131.9
  Top Layer w0.8: USB1.5 42.78,28.19 35.05,28.19 v1(35.05,21.97) C5.2 33.34,20.76 33.4,20.7 U1.12 ; 19.12,13.59 19.12,11.64 USB2.4 19.16,6.27 USB2.5 USB2.6 6.03,6.34 C4.2 6.03,17.84 6.1,17.91 3.18,17.91 3.05,18.03 3.05,21.84 11.94,21.84 11.94,16.89 C2.2 10.86,20.25 10.8,20.32 C1.2 ; v1(37.21,21.97) 37.21,17.07 USB1.4 42.78,15.07 USB1.6 41.56,14.77 USB3.4 36.55,8.97 USB3.5 USB3.6
  Bottom Layer w0.8: v1(35.05,21.97) v1(37.21,21.97)
U1_13: length 3.8
  Top Layer w0.8: U1.13 C5.1
U1_14: length 54.6
  Top Layer w0.8: U1.14 31.5,23.24 31.5,27.69 20.07,27.69 20.07,23.11 1.78,23.11 1.78,13.46 C4.1
USB1_1: length 11.3
  Top Layer w0.8: D1.2 36.07,19.43 36.07,24.13 36.12,24.07 USB1.1
USB1_2: length 19.4
  Top Layer w0.8: U1.9 v1(29.97,16.89) ; USB1.2 v1(38.35,21.57)
  Bottom Layer w0.8: v1(29.97,16.89) 28.96,16.89 28.96,20.7 38.35,20.7 v1(38.35,21.57)
USB1_3: length 14.1
  Top Layer w0.8: USB1.3 v1(38.48,19.57) ; U1.10 v1(30.03,18.16)
  Bottom Layer w0.8: v1(30.03,18.16) 38.48,18.16 v1(38.48,19.57)
USB2_2: length 19.6
  Top Layer w0.8: USB2.2 v1(11.95,12.45) ; U1.7 15.49,18.16 15.49,16.26 12.83,16.26 12.83,14.99 v1(11.94,14.99)
  Bottom Layer w0.8: 11.95,12.45 v1(11.94,14.99)
USB2_3: length 16.3
  Top Layer w0.8: U1.8 16.64,16.89 16.64,14.99 v1(13.97,14.99) ; USB2.3 v1(13.95,12.45)
  Bottom Layer w0.8: v1(13.97,14.99) 13.96,12.45
USB3_2: length 25.5
  Top Layer w0.8: U1.5 v1(19.94,20.7) ; USB3.2 v1(31.26,12.57)
  Bottom Layer w0.8: v1(19.94,20.7) 19.94,15.49 21.72,15.49 21.72,12.57 v1(31.26,12.57)
USB3_3: length 24.2
  Top Layer w0.8: U1.6 v1(20.96,19.43) ; USB3.3 v1(33.26,12.57)
  Bottom Layer w0.8: v1(20.96,19.43) 20.96,16.89 22.73,16.89 22.73,15.49 33.26,15.49 v1(33.26,12.57)
